# Altium schematic sheet MCU.SchDoc
size Tabloid; CompanyName: Ploopy Corporation; Organization: Ploopy Corporation; Address1: 137-1140 Burnhamthorpe Road W; Address2: Mississauga; Address3: Ontario; Address4: Canada L5C 0A3; DocumentNumber: 5; Revision: R1.001; SheetNumber: 5; SheetTotal: 8
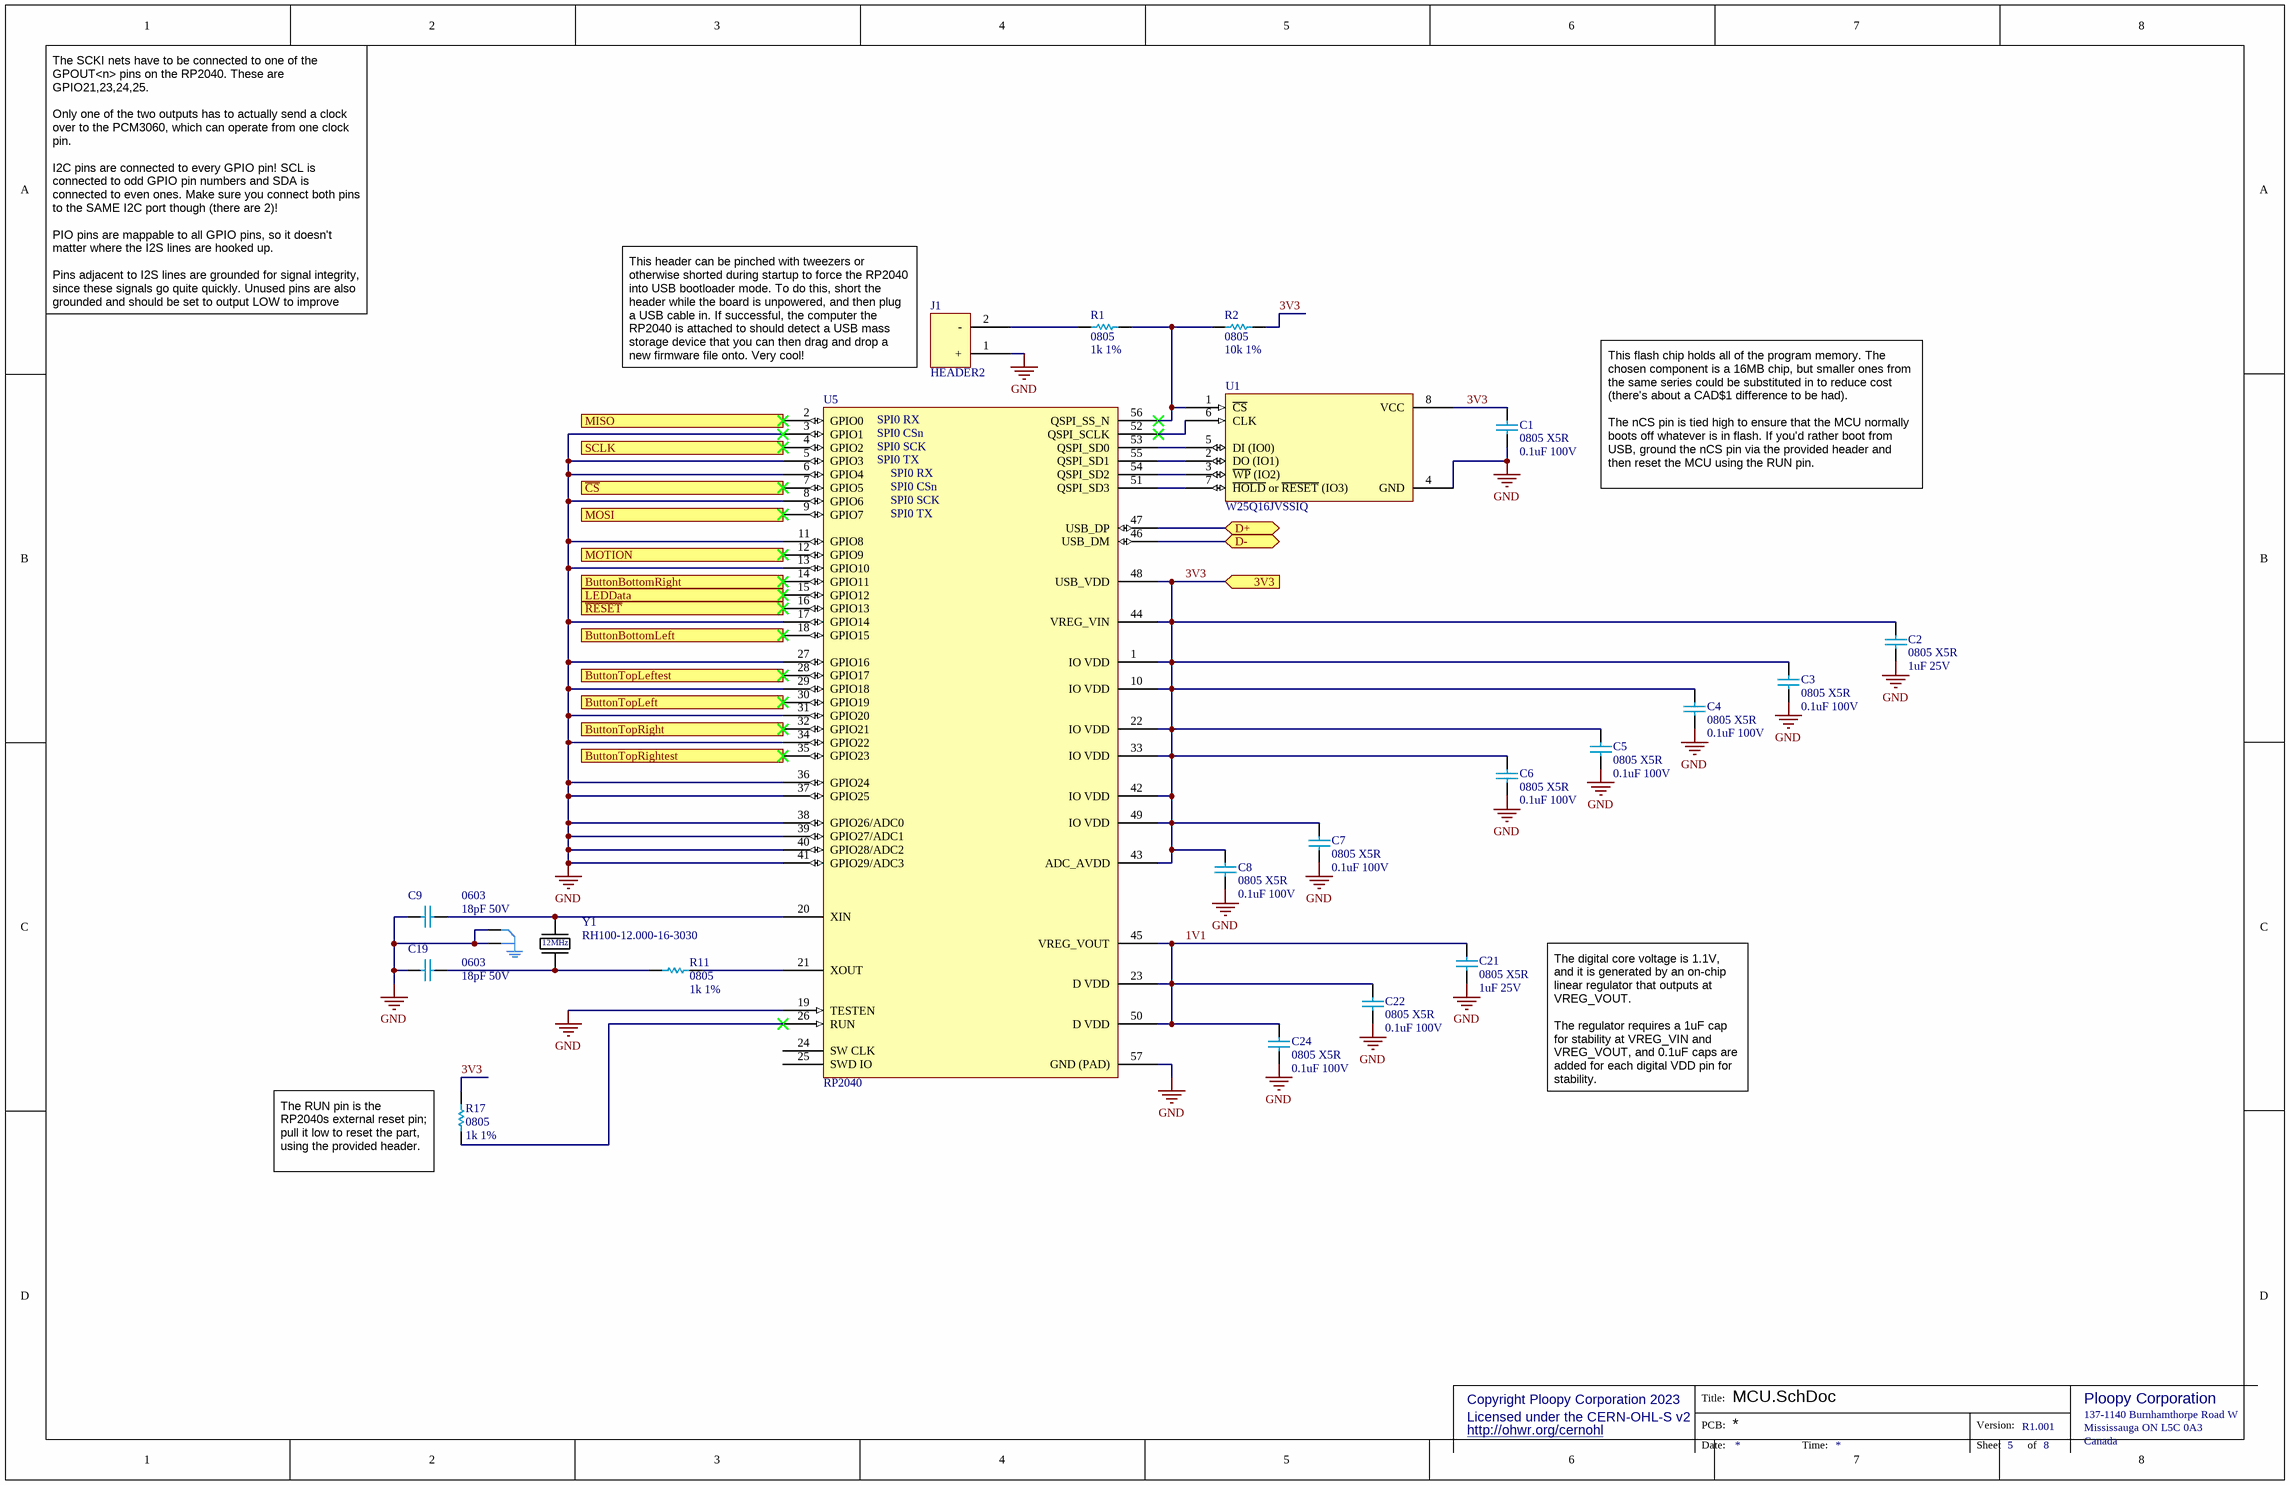
[diagram p0: MCU.SchDoc]

## Parts
C1  0805 X5R  value 0.1uF 100V  [0805 - TALL]
C2  0805 X5R  value 1uF 25V  [0805 - TALL]
C3  0805 X5R  value 0.1uF 100V  [0805 - TALL]
C4  0805 X5R  value 0.1uF 100V  [0805 - TALL]
C5  0805 X5R  value 0.1uF 100V  [0805 - TALL]
C6  0805 X5R  value 0.1uF 100V  [0805 - TALL]
C7  0805 X5R  value 0.1uF 100V  [0805 - TALL]
C8  0805 X5R  value 0.1uF 100V  [0805 - TALL]
C9  0603  value 18pF 50V  [0603]
C19  0603  value 18pF 50V  [0603]
C21  0805 X5R  value 1uF 25V  [0805 - TALL]
C22  0805 X5R  value 0.1uF 100V  [0805 - TALL]
C24  0805 X5R  value 0.1uF 100V  [0805 - TALL]
J1  HEADER2  [2x1]
R1  0805  value 1k 1%  [0805]
R2  0805  value 10k 1%  [0805]
R11  0805  value 1k 1%  [0805]
R17  0805  value 1k 1%  [0805]
U1  W25Q16JVSSIQ  [W25Q128JVS - SOIC127P790X216-8M]
U5  RP2040  [RP2040 - QFN40P700X700X90_HS-57M]
Y1  RH100-12.000-16-3030  [RH100-12.000-16-3030]

## Ports
3V3 (in), ButtonBottomLeft (in), ButtonBottomRight (in), ButtonTopLeft (in), ButtonTopLeftest (in), ButtonTopRight (in), ButtonTopRightest (in), D+ (bidir), D- (bidir), LEDData (out), MISO (in), MOSI (out), MOTION (in), SCLK (out), ~{CS} (out), ~{RESET} (out)

## Nets
GND: C1.1 C2.1 C3.1 C4.1 C5.1 C6.1 C7.1 C8.1 C9.2 C19.1 C21.1 C22.1 C24.1 J1.1(+) U1.4(GND) U5.3(GPIO1) U5.5(GPIO3) U5.6(GPIO4) U5.8(GPIO6) U5.11(GPIO8) U5.13(GPIO10) U5.17(GPIO14) U5.19(TESTEN) U5.27(GPIO16) U5.29(GPIO18) U5.31(GPIO20) U5.34(GPIO22) U5.36(GPIO24) U5.37(GPIO25) U5.38(GPIO26/ADC0) U5.39(GPIO27/ADC1) U5.40(GPIO28/ADC2) U5.41(GPIO29/ADC3) U5.57(GND_(PAD)) Y1.2 Y1.4
1V1: C21.2 C22.2 C24.2 U5.23(D_VDD) U5.45(VREG_VOUT) U5.50(D_VDD)
3V3: C1.2 C2.2 C3.2 C4.2 C5.2 C6.2 C7.2 C8.2 R2.1 R17.1 U1.8(VCC) U5.1(IO_VDD) U5.10(IO_VDD) U5.22(IO_VDD) U5.33(IO_VDD) U5.42(IO_VDD) U5.43(ADC_AVDD) U5.44(VREG_VIN) U5.48(USB_VDD) U5.49(IO_VDD) ; port 3V3
ButtonBottomLeft: U5.18(GPIO15) ; port ButtonBottomLeft
ButtonBottomRight: U5.14(GPIO11) ; port ButtonBottomRight
ButtonTopLeft: U5.30(GPIO19) ; port ButtonTopLeft
ButtonTopLeftest: U5.28(GPIO17) ; port ButtonTopLeftest
ButtonTopRight: U5.32(GPIO21) ; port ButtonTopRight
ButtonTopRightest: U5.35(GPIO23) ; port ButtonTopRightest
~{CS}: U5.7(GPIO5) ; port ~{CS}
D+: U5.47(USB_DP) ; port D+
D-: U5.46(USB_DM) ; port D-
LEDData: U5.15(GPIO12) ; port LEDData
MISO: U5.2(GPIO0) ; port MISO
MOSI: U5.9(GPIO7) ; port MOSI
MOTION: U5.12(GPIO9) ; port MOTION
~{RESET}: U5.16(GPIO13) ; port ~{RESET}
SCLK: U5.4(GPIO2) ; port SCLK
NetC9_1: C9.1 U5.20(XIN) Y1.1
NetC19_2: C19.2 R11.2 Y1.3
NetJ1_2: J1.2(-) R1.1
NetR1_2: R1.2 R2.2 U1.1(~{CS}) U5.56(QSPI_SS_N)
NetR11_1: R11.1 U5.21(XOUT)
NetR17_2: R17.2 U5.26(RUN)
NetU1_2: U1.2(DO_(IO1)) U5.55(QSPI_SD1)
NetU1_3: U1.3(~{WP}_(IO2)) U5.54(QSPI_SD2)
NetU1_5: U1.5(DI_(IO0)) U5.53(QSPI_SD0)
NetU1_6: U1.6(CLK) U5.52(QSPI_SCLK)
NetU1_7: U1.7(~{HOLD}_or_~{RESET}_(IO3)) U5.51(QSPI_SD3)

Not connected (* = marked no-connect by the designer): U5 24(SW_CLK) 25(SWD_IO)

## Notes on the sheet
- The SCKI nets have to be connected to one of the GPOUT<n> pins on the RP2040. These are GPIO21,23,24,25.
  Only one of the two outputs has to actually send a clock over to the PCM3060, which can operate from one clock pin.
  I2C pins are connected to every GPIO pin! SCL is connected to odd GPIO pin numbers and SDA is connected to even ones. Make sure you connect both pins to the SAME I2C port though (there are 2)!
  PIO pins are mappable to all GPIO pins, so it doesn't matter where the I2S lines are hooked up.
  Pins adjacent to I2S lines are grounded for signal integrity, since these signals go quite quickly. Unused pins are also grounded and should be set to output LOW to improve grounding.
- This header can be pinched with tweezers or otherwise shorted during startup to force the RP2040 into USB bootloader mode. To do this, short the header while the board is unpowered, and then plug a USB cable in. If successful, the computer the RP2040 is attached to should detect a USB mass storage device that you can then drag and drop a new firmware file onto. Very cool!
- (near U5) SPI0 RX
- (near U5) SPI0 CSn
- (near U5) SPI0 SCK
- (near U5) SPI0 TX
- This flash chip holds all of the program memory. The chosen component is a 16MB chip, but smaller ones from the same series could be substituted in to reduce cost (there's about a CAD$1 difference to be had).
  The nCS pin is tied high to ensure that the MCU normally boots off whatever is in flash. If you'd rather boot from USB, ground the nCS pin via the provided header and then reset the MCU using the RUN pin.
- The digital core voltage is 1.1V, and it is generated by an on-chip linear regulator that outputs at VREG_VOUT.
  The regulator requires a 1uF cap for stability at VREG_VIN and VREG_VOUT, and 0.1uF caps are added for each digital VDD pin for stability.
- (near R17) The RUN pin is the RP2040s external reset pin; pull it low to reset the part, using the provided header.
- Copyright Ploopy Corporation 2023
- Licensed under the CERN-OHL-S v2
- http://ohwr.org/cernohl
- Title:
- PCB:
- Version:
- Ploopy Corporation
- Mississauga ON L5C 0A3
- 137-1140 Burnhamthorpe Road W
- Date:
- Time:
- Sheet
- of
- Canada
- (in symbol RH100-12.000-16-3030) 12MHz

## Library data of the parts
C1 C3-C8 C22 C24 = Cap 0.1uF 100V: 0805, X5R or better; Supplier 1: Digi-Key; Supplier Part Number 1: 1276-6840-2-ND
C2 C21 = Cap 1uF 25V: 0805, X5R or better; Supplier 1: Digi-Key; Supplier Part Number 1: 1276-1066-2-ND; Supplier 2: Digi-Key; Supplier Part Number 2: 1276-1066-1-ND
C9 C19 = Cap 18pF 50V: 0603, C0G or better; Supplier 1: Digi-Key; Supplier Part Number 1: 1292-1494-1-ND
J1 = HEADER2: 2-pin 0.100" header; Supplier 1: Mouser; Supplier Part Number 1: 855-M20-9990245; Supplier 2: Digi-Key; Supplier Part Number 2: 952-2261-ND
R1 R11 R17 = Res 1k 1% 0805: Chip resistor, 1/8W 100PPM; Supplier 1: Digi-Key; Supplier Part Number 1: RMCF0805FT1K00TR-ND
R2 = Res 10k 1% 0805: Chip resistor; Supplier 1: Digi-Key; Supplier Part Number 1: RMCF0805FT10K0TR-ND
Y1 = RH100-12.000-16-3030: 12MHz Crystal 16pF 100 Ohms 4-SMD, No Lead (3.2mm x 2.5mm); Supplier 1: Digi-Key; Supplier 2: Mouser; Supplier Part Number 1: XC2686CT-ND; Supplier Part Number 2: 520-160-12-30B-AGMT
U1 = W25Q16JVSSIQ: Supplier 1: Digi-Key; Supplier Part Number 1: W25Q16JVSSIQ-ND
U5 = RP2040: Supplier 1: Newark; Supplier Part Number 1: 49AJ8740